# EasyEDA Pro project ProPrj_NUEDC_TI-2025_Ctrller_Pltform_2025-08-02.epro, schematic Schematic2
Board Name: STM32F407-TKX; Create Date: 2025-07-25; Page Name: P1; Project Name: NUEDC TI-2025 Ctrller Pltform; Schematic Name: Schematic2; Update Date: 2025-07-25; Company: CQUPT; Drawed: WilliTourt; Page Size: A3; Reviewed: WilliTourt; Version: V1.0
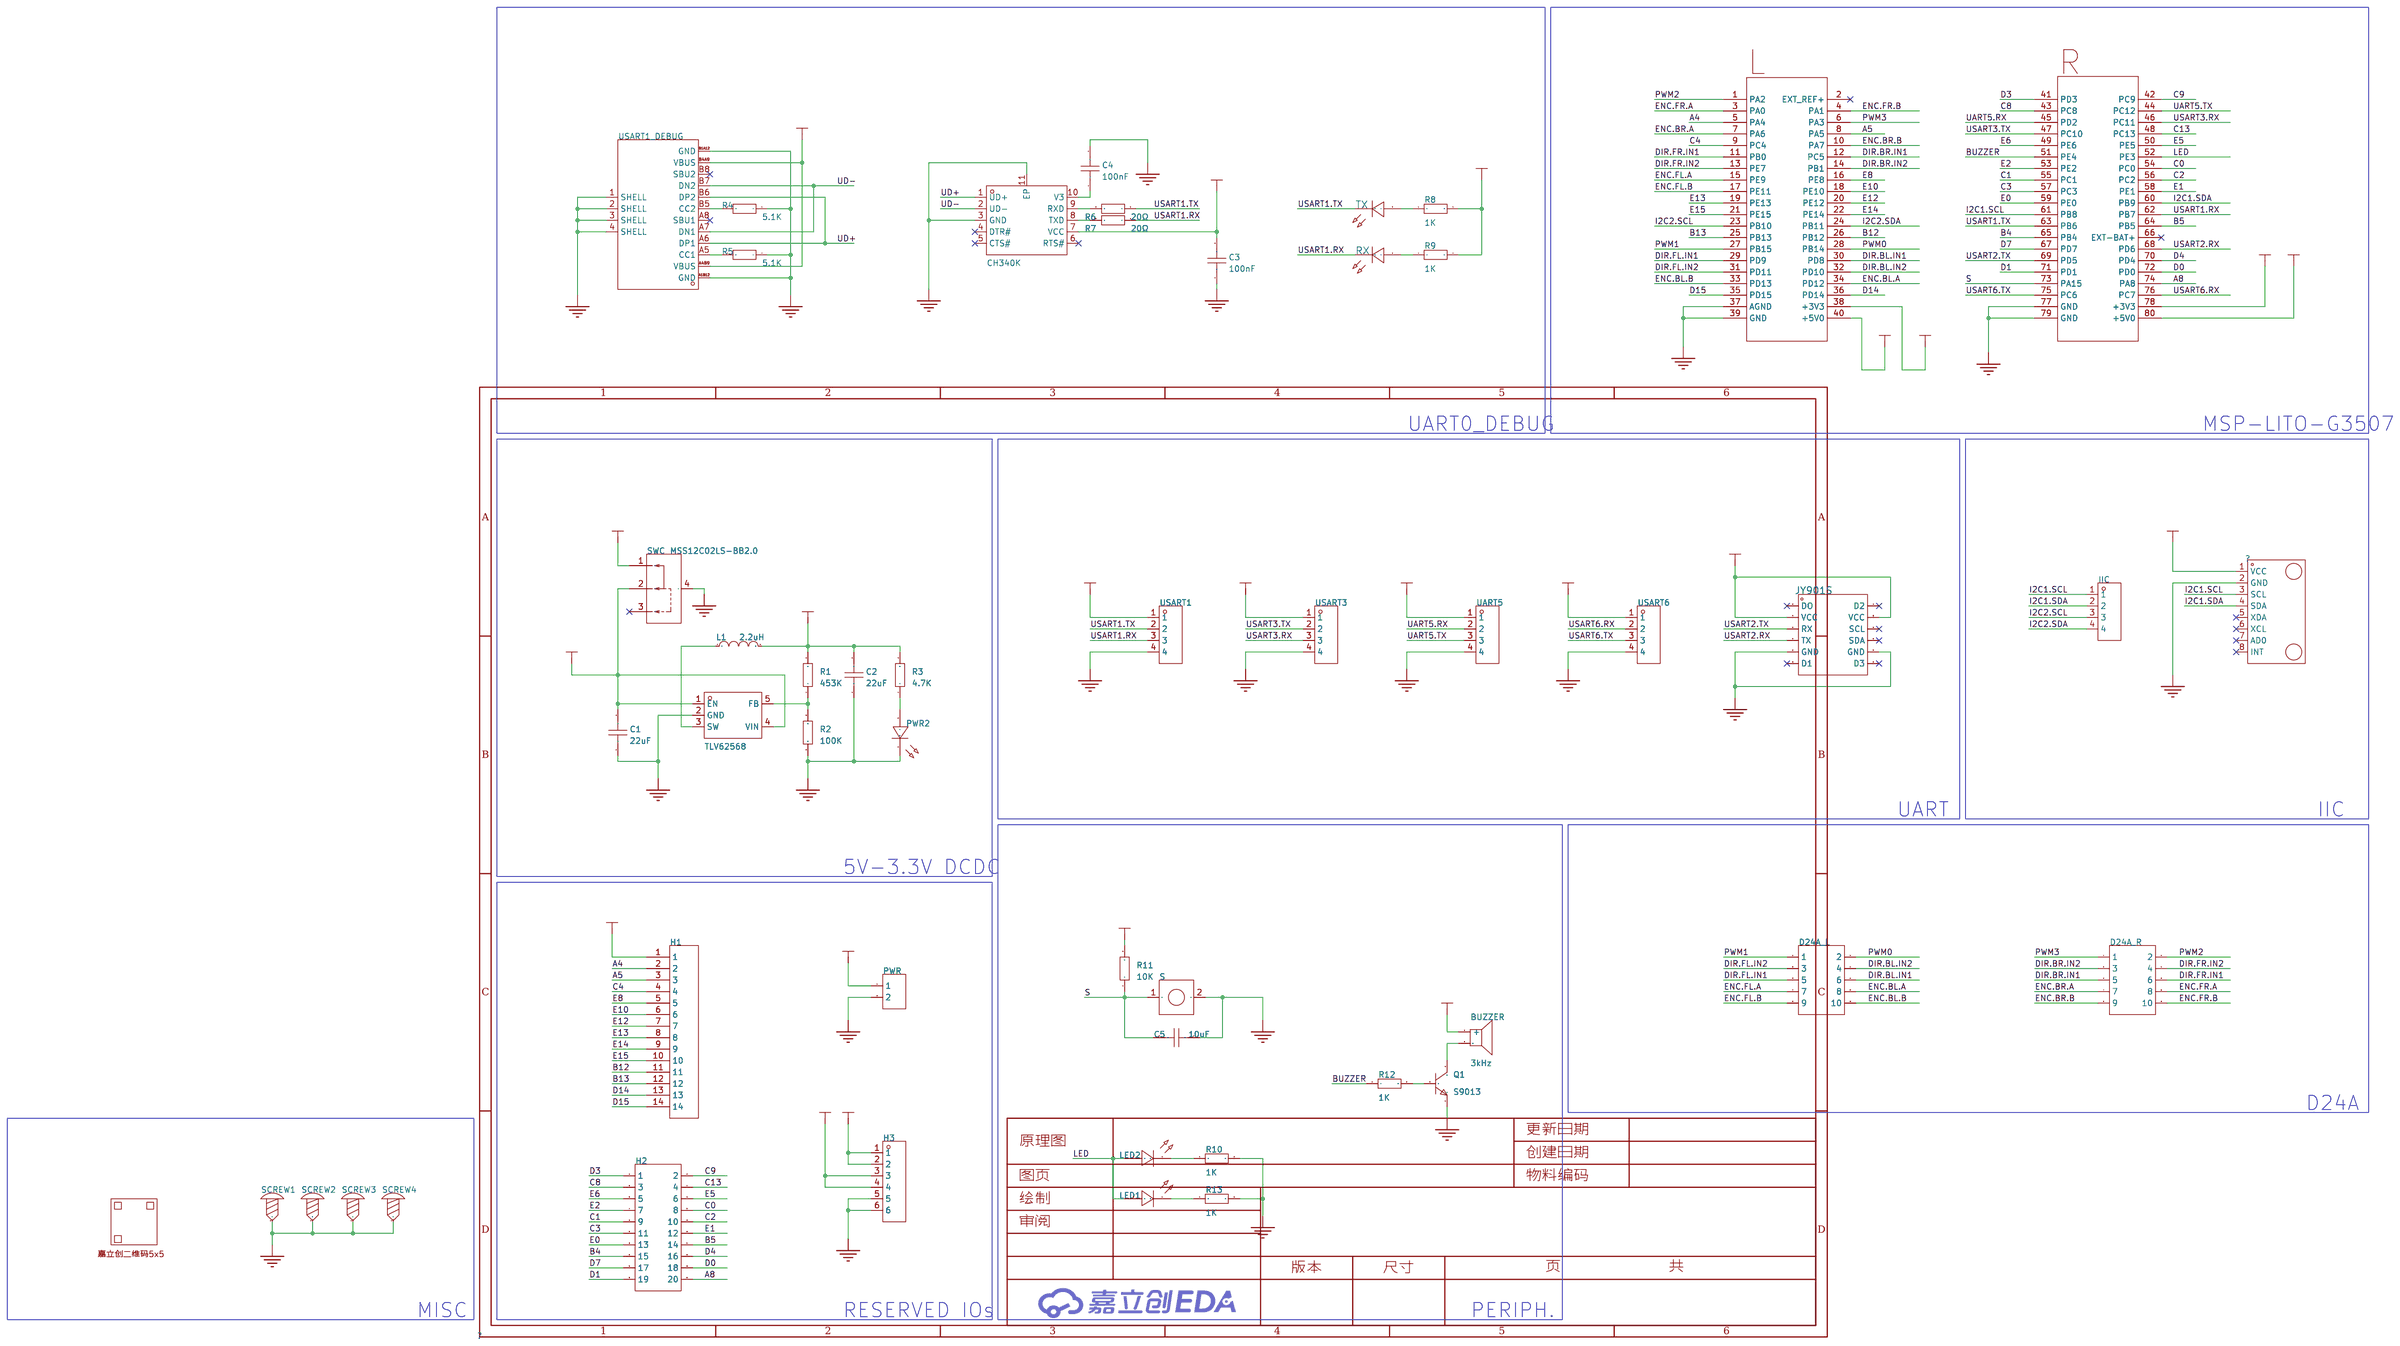
[diagram p1: schematic sheet]

## Parts
BUZZER  3kHz  [BUZ-SMD_L9.6-W9.6-LS10.0-R]
C1  22uF  [C0603]
C2  22uF  [C0603]
C3  100nF  [C0603]
C4  100nF  [C0603]
C5  10uF  [C0603]
CH340K  CH340K  [ESOP-10_L4.9-W3.9-P1.00-LS6.2-BL-EP]
D24A_L  -  [HDR-TH_10P-P2.54-V-F-R2-C5-S2.54]
D24A_R  -  [HDR-TH_10P-P2.54-V-F-R2-C5-S2.54]
H1  -  [HDR-TH_14P-P2.54-V-F-1]
H2  -  [HDR-TH_20P-P2.54-V-R2-C10-S2.54]
H3  -  [HDR-TH_6P-P2.54-V-F]
IIC  -  [HDR-TH_4P-P2.54-V-F]
JY901S  -  [JY901S]
L1  2.2uH  [IND-SMD_L3.0-W3.0_FNR30XXS]
LED1  -  [LED0603]
LED2  -  [LED0603]
MPU6050  -  [MPU6050]
PWR  -  [HDR-TH_2P-P2.54-V-F]
PWR2  -  [LED0603]
Q1  S9013  [SOT-23-3_L2.9-W1.4-P1.90-LS2.6-BR]
QR1  -  [JLC-QRCODE-5x5]
R1  453K  [R0603]
R2  100K  [R0603]
R3  4.7K  [R0603]
R4  5.1K  [R0603]
R5  5.1K  [R0603]
R6  20Ω  [R0603]
R7  20Ω  [R0603]
R8  1K  [R0603]
R9  1K  [R0603]
R10  1K  [R0603]
R11  10K  [R0603]
R12  1K  [R0603]
R13  1K  [R0603]
RX  -  [LED0603]
S  -  [6*6*5 硅胶开关]
SCREW1  -  [M3螺丝]
SCREW2  -  [M3螺丝]
SCREW3  -  [M3螺丝]
SCREW4  -  [M3螺丝]
SWC  MSS12C02LS-BB2.0  [SW-SMD_MSS12C02LS-HB2.0-1]
TLV62568  TLV62568DBVR  [SOT-23-5_L3.0-W1.7-P0.95-LS2.8-BR]
TX  -  [LED0603]
U1  -  [LCKFB-STM32F407-TKX]
UART5  -  [HDR-TH_4P-P2.54-V-F]
USART1  -  [HDR-TH_4P-P2.54-V-F]
USART1_DEBUG  Type-C-TOP_1  [USB-C-SMD_TYPE-C16PIN]
USART3  -  [HDR-TH_4P-P2.54-V-F]
USART6  -  [HDR-TH_4P-P2.54-V-F]

## Library data of the parts
BUZZER = FUET-9650B-3V: 驱动方式:有源(内含驱动线路);构造类型:电磁式;频率:3kHz;声压(SPL):85dB;; LCSC Part Name: 电压 3V 频率 3KHZ; Supplier Part: C391032; Manufacturer: FUET(福声科技); Supplier Footprint: SMD,9.6x9.6mm; JLCPCB Part Class: 扩展库; Datasheet: https://atta.szlcsc.com/upload/public/pdf/source/20191031/C391032_DAAC75D3C9B9135EF0EA60697D179A21.pdf; Supplier: LCSC; Driver Circuitry: 有源(内含驱动线路); Technology: 电磁式; Voltage - Supply: 2V~5V; Sound Pressure Level(SPL): 85dB; Length: 9.6mm; Width: 9.6mm; Height: 5.5mm
C1-C5 = C0603: Supplier Footprint: 0603
CH340K = CH340K: 应用功能:USB转串口;接口协议:USB 2.0;通道数:-;数据速率:2Mbps;; LCSC Part Name: USB转串口芯片CH340; Supplier Part: C968586; Manufacturer: WCH(南京沁恒); Supplier Footprint: ESSOP-10-150mil-1mm; JLCPCB Part Class: 扩展库; Datasheet: https://atta.szlcsc.com/upload/public/pdf/source/20240313/C21A12AB66F63ABF8F8743FF13A35C95.pdf; Supplier: LCSC; Applications Function: USB转串口; Protocol: USB 2.0; Voltage - Supply: 3.3V；5V; Data Rate: 2Mbps; Operating Temperature: -20℃~+70℃
D24A_L D24A_R = HDR-F_2.54_2x5: Supplier Part: C92270; Supplier Footprint: 插件
H1 = HDR-F-2.54_1x14P: Supplier Part: C52711; Supplier Footprint: 插件
H2 = HDR-F_2.54_2x10: Supplier Part: C30867; Supplier Footprint: 插件
H3 = HDR-F_2.54_1x6P: Supplier Part: C40877; Supplier Footprint: 插件
IIC UART5 USART1 USART3 USART6 = HDR-F_2.54_1x4P: Supplier Part: C2718488; Supplier Footprint: 插件
JY901S = JY901S
L1 = FNR3015S2R2MT: 电感值:2.2uH;精度:±20%;额定电流:2A;饱和电流(Isat):2A;; LCSC Part Name: 2.2uH ±20% 2A; Supplier Part: C167747; Manufacturer: cjiang(长江微电); Supplier Footprint: SMD,3x3mm; JLCPCB Part Class: 扩展库; Datasheet: https://atta.szlcsc.com/upload/public/pdf/source/20190327/C167925_9EFF0AABC4CA629C2CC95961DBF7D39D.pdf; Supplier: LCSC; Tolerance: ±20%; Rated Current: 2A; Saturation Current (Isat): 2A; DC Resistance (DCR): 78mΩ
LED1 LED2 = LED0603-WHITE
MPU6050 = MPU6050
PWR = HDR-F_2.54_1x2P: Supplier Part: C49661; Supplier Footprint: 插件
PWR2 = LED0603-GREEN
Q1 = S9013_C2836092: 晶体管类型:NPN;集电极电流(Ic):500mA;集射极击穿电压(Vceo):25V;功率(Pd):300mW;直流电流增益(hFE@Ic,Vce):120@50mA,1V;; LCSC Part Name: J3(J3表示丝印); Supplier Part: C2836092; Manufacturer: CBI(创基); Supplier Footprint: SOT-23; JLCPCB Part Class: 扩展库; Datasheet: https://atta.szlcsc.com/upload/public/pdf/source/20210621/C2836092_15188A6897D44309F7F2A6D715C57DA2.pdf; Supplier: LCSC; Transistor Type: NPN; Collector Current (Ic): 500mA; Collector-Emitter Breakdown Voltage (Vceo): 25V; Power Dissipation (Pd): 300mW; DC Current Gain (hFE@Ic,Vce): 120@50mA,1V; Transition Frequency (fT): 150MHz; Collector Cut-Off Current (Icbo): 100nA; Collector-Emitter Saturation Voltage (VCE(sat)@Ic,Ib): 600mV@500mA,50mA
QR1 = 嘉立创二维码5x5
R1-R13 = R0603: Supplier Footprint: 0603
RX TX = LED0603-ORANGE: Supplier Footprint: 0603
S = 6*6*5 硅胶开关
SCREW1-SCREW4 = M3螺丝: Supplier Footprint: 插件
SWC = MSS12C02LS-BB2.0: 电路结构:单刀双掷;安装方式:立贴;开关颜色:-;额定电流(DC):100mA;额定电压(DC):12V;额定电流(AC):-;额定电压(AC):-;机械寿命:1万次;; Supplier Part: C3008585; Manufacturer: SHOU HAN(首韩); Supplier Footprint: SMD; JLCPCB Part Class: 扩展库; Datasheet: https://atta.szlcsc.com/upload/public/pdf/source/20220429/8AEFBC67104491914BC5659DE1F359A3.pdf; Supplier: LCSC; Circuit: 单刀双掷; Pin Style: SMD接片; Switch Length: 6.65mm; Switch Width: 2.75mm; Switch Height: 1.4mm; Mounting Style: 立贴; Current Rating (DC): 100mA; Voltage Rating (DC): 12V; Mechanical Life: 1万次; Operating Temperature: -25℃~+70℃
TLV62568 = TLV62568DBVR: 功能类型:降压型;输出类型:可调;工作电压:2.5V~5.5V;输出电压:600mV~5.5V;输出电流:1A;; LCSC Part Name: 1A高效同步降压转换器; Supplier Part: C163219; Manufacturer: TI(德州仪器); Supplier Footprint: SOT-23-5; JLCPCB Part Class: 扩展库; Datasheet: https://www.ti.com/cn/lit/gpn/tlv62568; Supplier: LCSC; Function: 降压型; Output Type: 可调; Input Voltage: 2.5V~5.5V; Output Voltage: 600mV~5.5V; Output Current: 1A; Switching Frequency: 1.5MHz; Operating Temperature: -40℃~+125℃@(TJ); Synchronous Rectification: 是; Number of Outputs: 1; Topology: 降压式; Switch tube (built-in/external): 内置
U1 = LCKFB-STM32F407-TKX: Supplier Part: C22370035; Supplier: LCSC
USART1_DEBUG = Type-C-TOP_1: Supplier Part: C9900005857; Supplier Footprint: Type-C16P; JLCPCB Part Class: 扩展库; Supplier: LCSC; Check: false

## Nets
3V3: BUZZER.1(+) C2.2 C3.2 CH340K.7(VCC) H1.1 H3.3 H3.4 JY901S.2(VCC) JY901S.8(VCC) L1.2 MPU6050.1(VCC) R1.2 R3.2 R8.2 R9.2 R11.2 U1.38(+3V3) U1.78(+3V3) UART5.1 USART1.1 USART3.1 USART6.1
5V: C1.2 H3.1 H3.2 SWC.2 TLV62568.1(EN) TLV62568.4(VIN) U1.40(+5V0) U1.80(+5V0)
5VIN: PWR.1 SWC.1 USART1_DEBUG.A4B9(VBUS) USART1_DEBUG.B4A9(VBUS)
GND: C1.1 C2.1 C3.1 C4.2 C5.1 CH340K.3(GND) CH340K.11(EP) H3.5 H3.6 JY901S.5(GND) JY901S.11(GND) MPU6050.2(GND) PWR.2 PWR2.1(C) Q1.2(E) R2.1 R4.1 R5.1 R10.2 R13.2 S.2 SCREW1.1 SCREW2.1 SCREW3.1 SCREW4.1 SWC.4 TLV62568.2(GND) U1.37(AGND) U1.39(GND) U1.77(GND) U1.79(GND) UART5.4 USART1.4 USART1_DEBUG.1(SHELL) USART1_DEBUG.2(SHELL) USART1_DEBUG.3(SHELL) USART1_DEBUG.4(SHELL) USART1_DEBUG.A1B12(GND) USART1_DEBUG.B1A12(GND) USART3.4 USART6.4
A4: H1.2 U1.5(PA4)
A5: H1.3 U1.8(PA5)
A8: H2.20 U1.74(PA8)
B4: H2.15 U1.65(PB4)
B5: H2.14 U1.64(PB5)
B12: H1.11 U1.26(PB12)
B13: H1.12 U1.25(PB13)
BUZZER: R12.1 U1.51(PE4)
C0: H2.8 U1.54(PC0)
C1: H2.9 U1.55(PC1)
C2: H2.10 U1.56(PC2)
C3: H2.11 U1.57(PC3)
C4: H1.4 U1.9(PC4)
C8: H2.3 U1.43(PC8)
C9: H2.2 U1.42(PC9)
C13: H2.4 U1.48(PC13)
D0: H2.18 U1.72(PD0)
D1: H2.19 U1.71(PD1)
D3: H2.1 U1.41(PD3)
D4: H2.16 U1.70(PD4)
D7: H2.17 U1.67(PD7)
D14: H1.13 U1.36(PD14)
D15: H1.14 U1.35(PD15)
DIR.BL.IN1: D24A_L.6 U1.30(PD8)
DIR.BL.IN2: D24A_L.4 U1.32(PD10)
DIR.BR.IN1: D24A_R.5 U1.12(PC5)
DIR.BR.IN2: D24A_R.3 U1.14(PB1)
DIR.FL.IN1: D24A_L.5 U1.29(PD9)
DIR.FL.IN2: D24A_L.3 U1.31(PD11)
DIR.FR.IN1: D24A_R.6 U1.11(PB0)
DIR.FR.IN2: D24A_R.4 U1.13(PE7)
E0: H2.13 U1.59(PE0)
E1: H2.12 U1.58(PE1)
E2: H2.7 U1.53(PE2)
E5: H2.6 U1.50(PE5)
E6: H2.5 U1.49(PE6)
E8: H1.5 U1.16(PE8)
E10: H1.6 U1.18(PE10)
E12: H1.7 U1.20(PE12)
E13: H1.8 U1.19(PE13)
E14: H1.9 U1.22(PE14)
E15: H1.10 U1.21(PE15)
ENC.BL.A: D24A_L.8 U1.34(PD12)
ENC.BL.B: D24A_L.10 U1.33(PD13)
ENC.BR.A: D24A_R.7 U1.7(PA6)
ENC.BR.B: D24A_R.9 U1.10(PA7)
ENC.FL.A: D24A_L.7 U1.15(PE9)
ENC.FL.B: D24A_L.9 U1.17(PE11)
ENC.FR.A: D24A_R.8 U1.3(PA0)
ENC.FR.B: D24A_R.10 U1.4(PA1)
I2C1.SCL: IIC.1 MPU6050.3(SCL) U1.61(PB8)
I2C1.SDA: IIC.2 MPU6050.4(SDA) U1.60(PB9)
I2C2.SCL: IIC.3 U1.23(PB10)
I2C2.SDA: IIC.4 U1.24(PB11)
LED: LED1.2(A) LED2.2(A) U1.52(PE3)
PWM0: D24A_L.2 U1.28(PB14)
PWM1: D24A_L.1 U1.27(PB15)
PWM2: D24A_R.2 U1.1(PA2)
PWM3: D24A_R.1 U1.6(PA3)
S: C5.2 R11.1 S.1 U1.73(PA15)
UART5.RX: U1.45(PD2) UART5.2
UART5.TX: U1.44(PC12) UART5.3
UD+: CH340K.1(UD+) USART1_DEBUG.A6(DP1) USART1_DEBUG.B6(DP2)
UD-: CH340K.2(UD-) USART1_DEBUG.A7(DN1) USART1_DEBUG.B7(DN2)
USART1.RX: R7.1 RX.1(C) U1.62(PB7) USART1.3
USART1.TX: R6.1 TX.1(C) U1.63(PB6) USART1.2
USART2.RX: JY901S.4(TX) U1.68(PD6)
USART2.TX: JY901S.3(RX) U1.69(PD5)
USART3.RX: U1.46(PC11) USART3.3
USART3.TX: U1.47(PC10) USART3.2
USART6.RX: U1.76(PC7) USART6.2
USART6.TX: U1.75(PC6) USART6.3
$1N2281: C4.1 CH340K.10(V3)
$1N2282: CH340K.9(RXD) R6.2
$1N2283: CH340K.8(TXD) R7.2
$1N2289: R8.1 TX.2(A)
$1N2292: R9.1 RX.2(A)
$1N2391: BUZZER.2 Q1.3(C)
$1N2476: LED2.1(C) R10.1
$1N2481: Q1.1(B) R12.2
Net-(L1-1): L1.1 TLV62568.3(SW)
Net-(LED1-1): LED1.1(C) R13.1
Net-(PWR2-2): PWR2.2(A) R3.1
Net-(R1-1): R1.1 R2.2 TLV62568.5(FB)
Net-(R4-2): R4.2 USART1_DEBUG.B5(CC2)
Net-(R5-2): R5.2 USART1_DEBUG.A5(CC1)

Not connected (* = marked no-connect by the designer): CH340K 4(DTR#)* 5(CTS#)* 6(RTS#)*; JY901S 1(DO)* 6(D1)* 7(D2)* 9(SCL)* 10(SDA)* 12(D3)*; MPU6050 5(XDA)* 6(XCL)* 7(AD0)* 8(INT)*; SWC 3*; U1 2(EXT REF+)* 66(EXT-BAT+)*; USART1_DEBUG A8(SBU1)* B8(SBU2)*

## Notes on the sheet
- UART0_DEBUG
- MSP-LITO-G3507
- UART
- IIC
- 5V-3.3V DCDC
- D24A
- MISC
- RESERVED IOs
- PERIPH.
